# Altium schematic sheet FPGA.SchDoc: Humpback
size 420 x 297 mm; EDA_Number: ARTIQ; Projet: Humpback; Author: G.Kasprowicz; CompanyName: WUT ISE; DrawnBy: G.Kasprowicz; Organization: WUT ISE; Address1: PW ISE; Address2: Nowowiejska 15/19 00-665 Warsaw; Address3: gkasprow@gmail.com; DocumentNumber: 2; Revision: 1.0; SheetNumber: 2; SheetTotal: 11; ModifiedBy: -; CheckedDate: -; Title2: FPGA v1.0; DivGrp: WUT ISE; Designer: G.Kasprowicz; ModifiedDate: -; ProjectName: Sensor Box
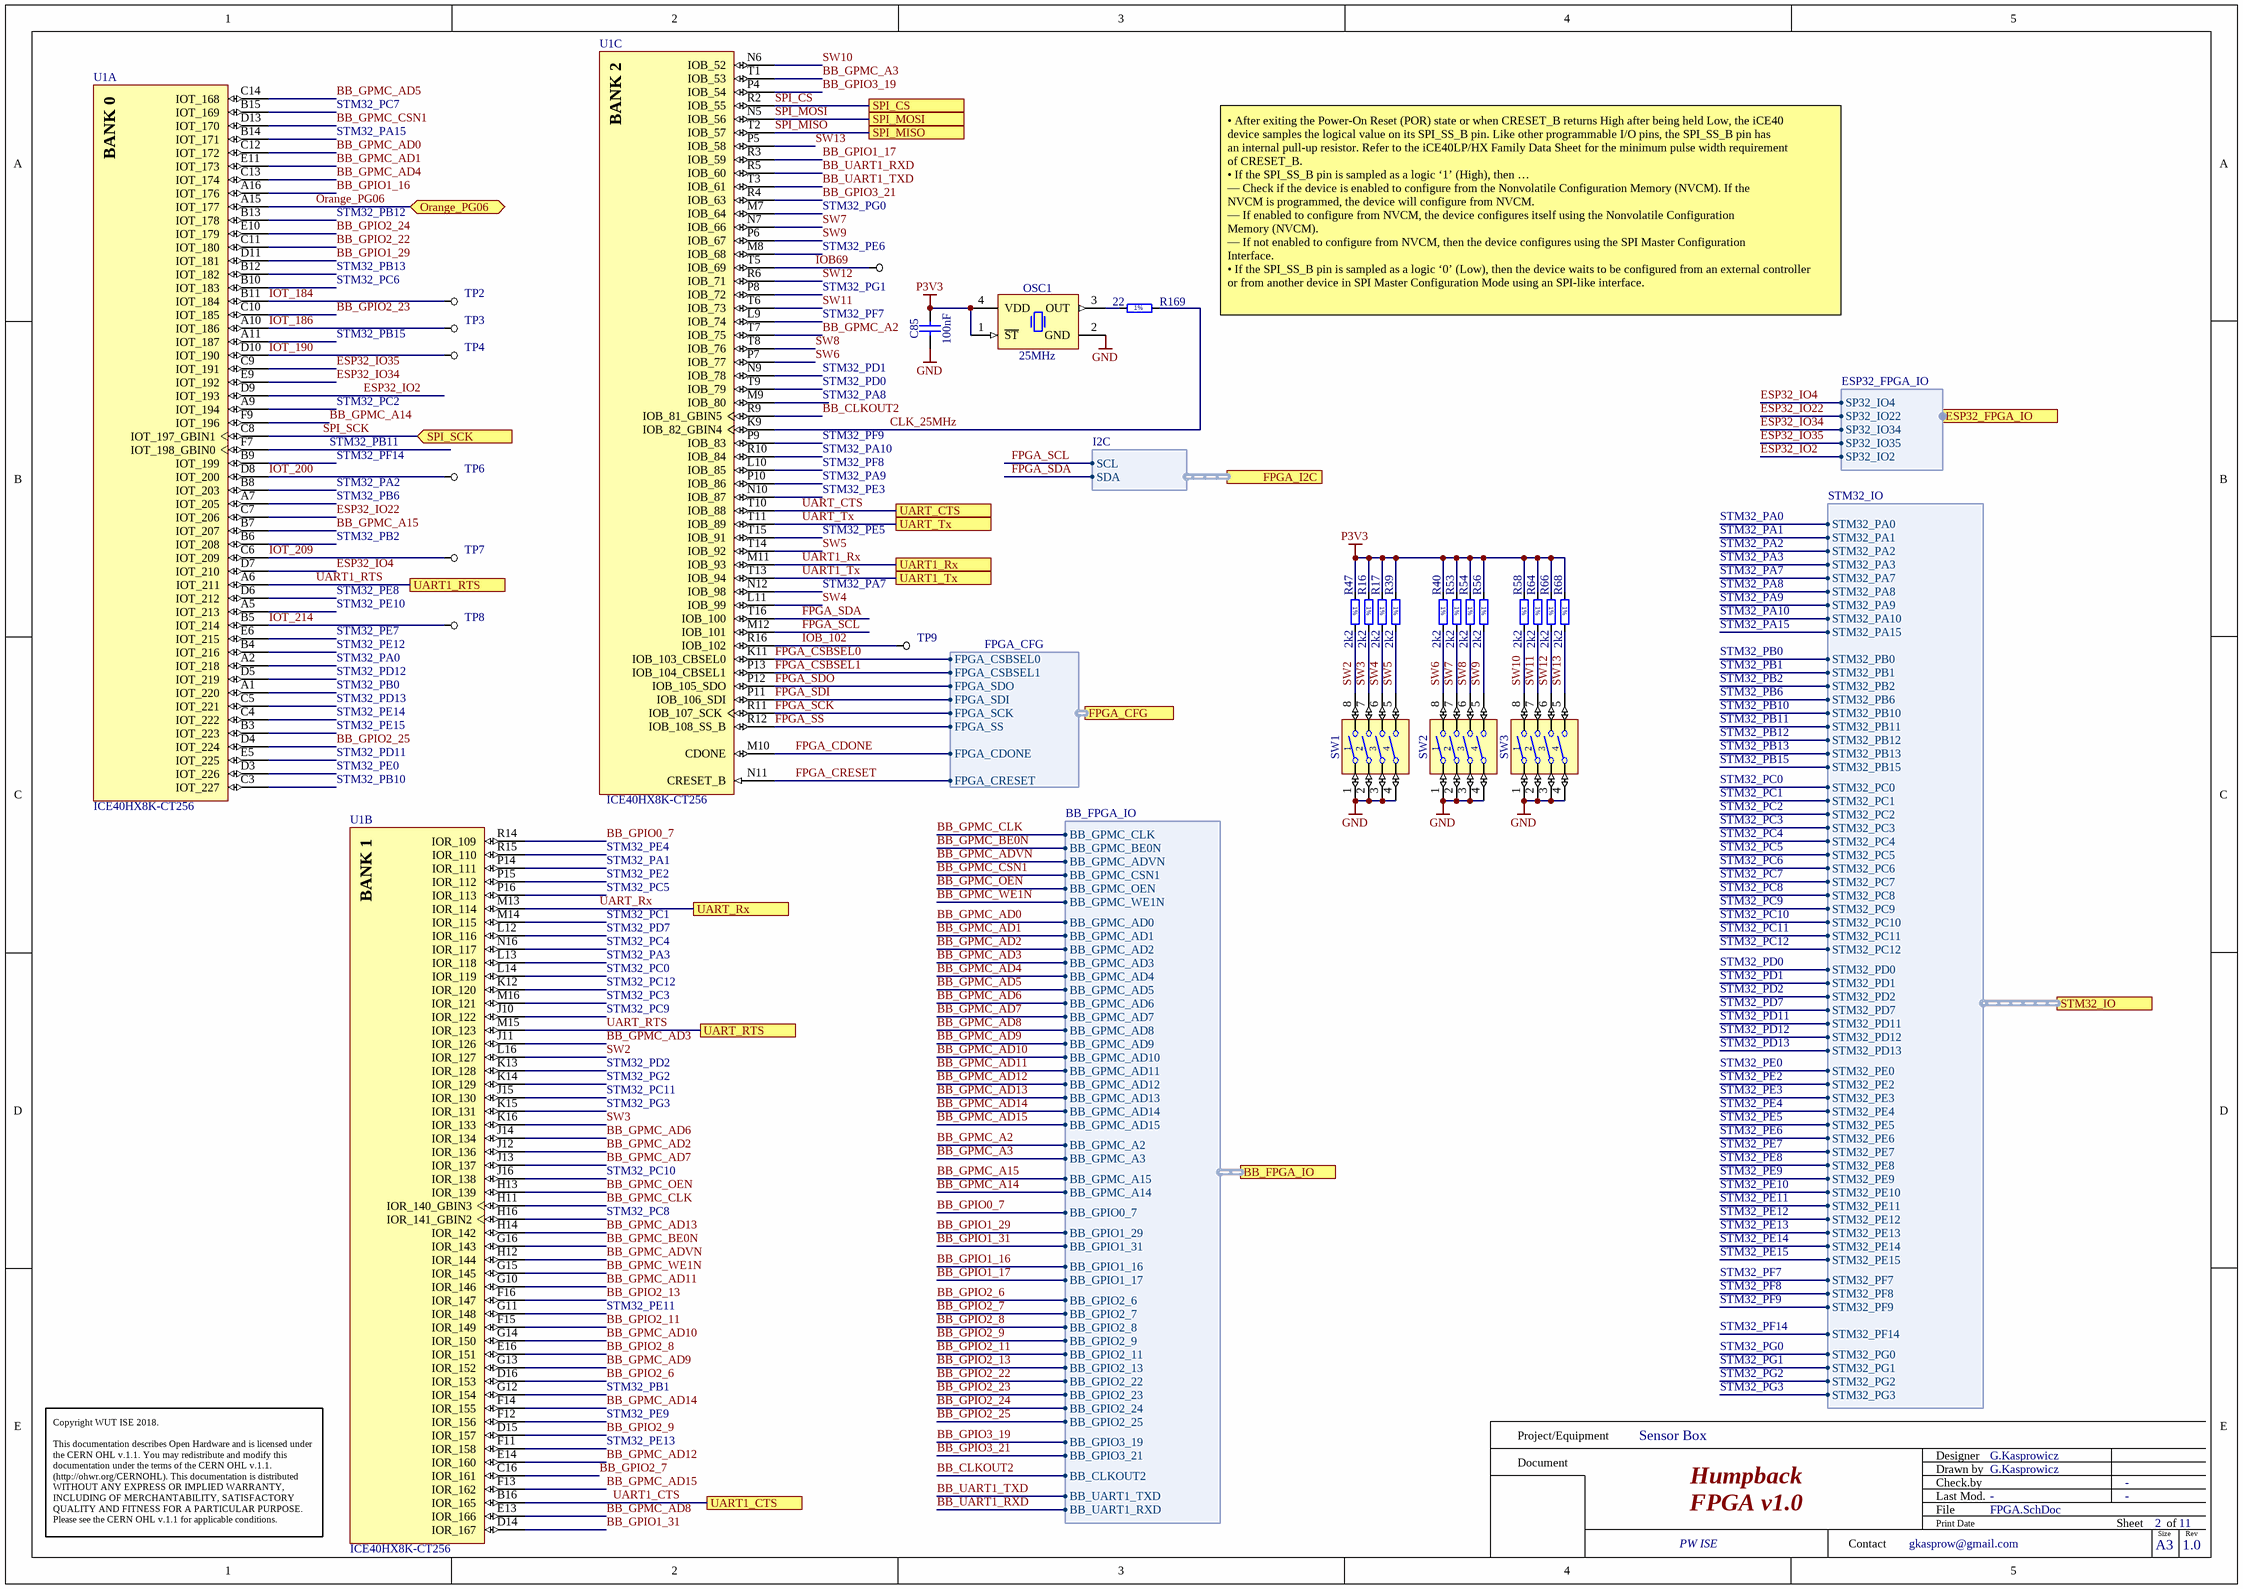
[diagram p0: FPGA.SchDoc]

## Parts
?  TP  [TP]  (value not drawn)
C85  100nF  [CAPC1005X55N]
OSC1  25MHz  [OSC_MICROCHIP_CDFN2520-4LD-PL-1]
R16  2k2  [RESC1005X40N]
R17  2k2  [RESC1005X40N]
R39  2k2  [RESC1005X40N]
R40  2k2  [RESC1005X40N]
R47  2k2  [RESC1005X40N]
R53  2k2  [RESC1005X40N]
R54  2k2  [RESC1005X40N]
R56  2k2  [RESC1005X40N]
R58  2k2  [RESC1005X40N]
R64  2k2  [RESC1005X40N]
R66  2k2  [RESC1005X40N]
R68  2k2  [RESC1005X40N]
R169  22  [RESC1005X40N]
SW1  Switch  [SW_TYCO_1571983-4]  (value not drawn)
SW2  Switch  [SW_TYCO_1571983-4]  (value not drawn)
SW3  Switch  [SW_TYCO_1571983-4]  (value not drawn)
TP2  TP  [TP]  (value not drawn)
TP3  TP  [TP]  (value not drawn)
TP4  TP  [TP]  (value not drawn)
TP6  TP  [TP]  (value not drawn)
TP7  TP  [TP]  (value not drawn)
TP8  TP  [TP]  (value not drawn)
TP9  TP  [TP]  (value not drawn)
U1  ICE40HX8K-CT256  [LATC-caBGA-256]  (parts A,B,C of 5)

## Ports
BB_FPGA_IO (harness BB_FPGA_IO), ESP32_FPGA_IO (harness ESP32_FPGA_IO), FPGA_CFG (harness FPGA_CFG), FPGA_I2C (harness I2C), Orange_PG06 (bidir), SPI_CS, SPI_MISO, SPI_MOSI, SPI_SCK (in), STM32_IO (harness STM32_IO), UART1_CTS, UART1_RTS, UART1_Rx, UART1_Tx, UART_CTS, UART_RTS, UART_Rx, UART_Tx

## Harnesses
I2C: SDA, SCL
FPGA_CFG: FPGA_CSBSEL0, FPGA_CSBSEL1, FPGA_SDO, FPGA_SDI, FPGA_SCK, FPGA_SS, FPGA_CDONE, FPGA_CRESET
STM32_IO: STM32_PA0, STM32_PA1, STM32_PA2, STM32_PA3, STM32_PA7, STM32_PA8, STM32_PA9, STM32_PA10, STM32_PA15, STM32_PB0, STM32_PB1, STM32_PB2, STM32_PB6, STM32_PB10, STM32_PB11, STM32_PB12, STM32_PB13, STM32_PB15, STM32_PC0, STM32_PC1, STM32_PC2, STM32_PC3, STM32_PC4, STM32_PC5, STM32_PC6, STM32_PC7, STM32_PC8, STM32_PC9, STM32_PC10, STM32_PC11, STM32_PC12, STM32_PD0, STM32_PD1, STM32_PD2, STM32_PD7, STM32_PD11, STM32_PD12, STM32_PD13, STM32_PE0, STM32_PE2, STM32_PE3, STM32_PE4, STM32_PE5, STM32_PE6, STM32_PE7, STM32_PE8, STM32_PE9, STM32_PE10, STM32_PE11, STM32_PE12, STM32_PE13, STM32_PE14, STM32_PE15, STM32_PF7, STM32_PF8, STM32_PF9, STM32_PF14, STM32_PG0, STM32_PG1, STM32_PG2, STM32_PG3
BB_FPGA_IO: BB_GPMC_CLK, BB_GPMC_BE0N, BB_GPMC_CSN1, BB_GPMC_OEN, BB_GPMC_AD0, BB_GPMC_AD1, BB_GPMC_AD2, BB_GPMC_AD3, BB_GPMC_AD4, BB_GPMC_AD5, BB_GPMC_AD6, BB_GPMC_AD7, BB_GPMC_AD8, BB_GPMC_AD9, BB_GPMC_AD10, BB_GPMC_AD11, BB_GPMC_AD12, BB_GPMC_AD13, BB_GPMC_AD14, BB_GPMC_AD15, BB_GPMC_A2, BB_GPMC_A3, BB_GPMC_A15, BB_GPMC_A14, BB_GPIO0_7, BB_GPIO1_29, BB_GPIO1_31, BB_GPIO1_16, BB_GPIO1_17, BB_GPIO2_6, BB_GPIO2_7, BB_GPIO2_8, BB_GPIO2_9, BB_GPIO2_11, BB_GPIO2_13, BB_GPIO2_22, BB_GPIO2_23, BB_GPIO2_24, BB_GPIO2_25, BB_GPIO3_19, BB_GPIO3_21, BB_CLKOUT2, BB_UART1_TXD, BB_UART1_RXD, BB_GPMC_ADVN, BB_GPMC_WE1N
ESP32_FPGA_IO: SP32_IO4, SP32_IO22, SP32_IO34, SP32_IO35, SP32_IO2

## Nets
GND: C85.1 OSC1.2(GND) SW1.1 SW1.2 SW1.3 SW1.4 SW2.1 SW2.2 SW2.3 SW2.4 SW3.1 SW3.2 SW3.3 SW3.4
P3V3: C85.2 OSC1.1(~{ST}) OSC1.4(VDD) R16.1 R17.1 R39.1 R40.1 R47.1 R53.1 R54.1 R56.1 R58.1 R64.1 R66.1 R68.1
BB_CLKOUT2: U1.R9(IOB_81_GBIN5) ; port BB_FPGA_IO.BB_CLKOUT2
BB_GPIO0_7: U1.R14(IOR_109) ; port BB_FPGA_IO.BB_GPIO0_7
BB_GPIO1_16: U1.A16(IOT_176) ; port BB_FPGA_IO.BB_GPIO1_16
BB_GPIO1_17: U1.R3(IOB_59) ; port BB_FPGA_IO.BB_GPIO1_17
BB_GPIO1_29: U1.D11(IOT_181) ; port BB_FPGA_IO.BB_GPIO1_29
BB_GPIO1_31: U1.D14(IOR_167) ; port BB_FPGA_IO.BB_GPIO1_31
BB_GPIO2_6: U1.D16(IOR_153) ; port BB_FPGA_IO.BB_GPIO2_6
BB_GPIO2_7: U1.C16(IOR_161) ; port BB_FPGA_IO.BB_GPIO2_7
BB_GPIO2_8: U1.E16(IOR_151) ; port BB_FPGA_IO.BB_GPIO2_8
BB_GPIO2_9: U1.D15(IOR_157) ; port BB_FPGA_IO.BB_GPIO2_9
BB_GPIO2_11: U1.F15(IOR_149) ; port BB_FPGA_IO.BB_GPIO2_11
BB_GPIO2_13: U1.F16(IOR_147) ; port BB_FPGA_IO.BB_GPIO2_13
BB_GPIO2_22: U1.C11(IOT_180) ; port BB_FPGA_IO.BB_GPIO2_22
BB_GPIO2_23: U1.C10(IOT_185) ; port BB_FPGA_IO.BB_GPIO2_23
BB_GPIO2_24: U1.E10(IOT_179) ; port BB_FPGA_IO.BB_GPIO2_24
BB_GPIO2_25: U1.D4(IOT_224) ; port BB_FPGA_IO.BB_GPIO2_25
BB_GPIO3_19: U1.P4(IOB_54) ; port BB_FPGA_IO.BB_GPIO3_19
BB_GPIO3_21: U1.R4(IOB_63) ; port BB_FPGA_IO.BB_GPIO3_21
BB_GPMC_A2: U1.T7(IOB_75) ; port BB_FPGA_IO.BB_GPMC_A2
BB_GPMC_A3: U1.T1(IOB_53) ; port BB_FPGA_IO.BB_GPMC_A3
BB_GPMC_A14: U1.F9(IOT_196) ; port BB_FPGA_IO.BB_GPMC_A14
BB_GPMC_A15: U1.B7(IOT_207) ; port BB_FPGA_IO.BB_GPMC_A15
BB_GPMC_AD0: U1.C12(IOT_172) ; port BB_FPGA_IO.BB_GPMC_AD0
BB_GPMC_AD1: U1.E11(IOT_173) ; port BB_FPGA_IO.BB_GPMC_AD1
BB_GPMC_AD2: U1.J12(IOR_136) ; port BB_FPGA_IO.BB_GPMC_AD2
BB_GPMC_AD3: U1.J11(IOR_126) ; port BB_FPGA_IO.BB_GPMC_AD3
BB_GPMC_AD4: U1.C13(IOT_174) ; port BB_FPGA_IO.BB_GPMC_AD4
BB_GPMC_AD5: U1.C14(IOT_168) ; port BB_FPGA_IO.BB_GPMC_AD5
BB_GPMC_AD6: U1.J14(IOR_134) ; port BB_FPGA_IO.BB_GPMC_AD6
BB_GPMC_AD7: U1.J13(IOR_137) ; port BB_FPGA_IO.BB_GPMC_AD7
BB_GPMC_AD8: U1.E13(IOR_166) ; port BB_FPGA_IO.BB_GPMC_AD8
BB_GPMC_AD9: U1.G13(IOR_152) ; port BB_FPGA_IO.BB_GPMC_AD9
BB_GPMC_AD10: U1.G14(IOR_150) ; port BB_FPGA_IO.BB_GPMC_AD10
BB_GPMC_AD11: U1.G10(IOR_146) ; port BB_FPGA_IO.BB_GPMC_AD11
BB_GPMC_AD12: U1.E14(IOR_160) ; port BB_FPGA_IO.BB_GPMC_AD12
BB_GPMC_AD13: U1.H14(IOR_142) ; port BB_FPGA_IO.BB_GPMC_AD13
BB_GPMC_AD14: U1.F14(IOR_155) ; port BB_FPGA_IO.BB_GPMC_AD14
BB_GPMC_AD15: U1.F13(IOR_162) ; port BB_FPGA_IO.BB_GPMC_AD15
BB_GPMC_ADVN: U1.H12(IOR_144) ; port BB_FPGA_IO.BB_GPMC_ADVN
BB_GPMC_BE0N: U1.G16(IOR_143) ; port BB_FPGA_IO.BB_GPMC_BE0N
BB_GPMC_CLK: U1.H11(IOR_140_GBIN3) ; port BB_FPGA_IO.BB_GPMC_CLK
BB_GPMC_CSN1: U1.D13(IOT_170) ; port BB_FPGA_IO.BB_GPMC_CSN1
BB_GPMC_OEN: U1.H13(IOR_139) ; port BB_FPGA_IO.BB_GPMC_OEN
BB_GPMC_WE1N: U1.G15(IOR_145) ; port BB_FPGA_IO.BB_GPMC_WE1N
BB_UART1_RXD: U1.R5(IOB_60) ; port BB_FPGA_IO.BB_UART1_RXD
BB_UART1_TXD: U1.T3(IOB_61) ; port BB_FPGA_IO.BB_UART1_TXD
CLK_25MHz: R169.2 U1.K9(IOB_82_GBIN4)
ESP32_IO2: U1.D9(IOT_193) ; port ESP32_FPGA_IO.SP32_IO2
ESP32_IO4: U1.D7(IOT_210) ; port ESP32_FPGA_IO.SP32_IO4
ESP32_IO22: U1.C7(IOT_206) ; port ESP32_FPGA_IO.SP32_IO22
ESP32_IO34: U1.E9(IOT_192) ; port ESP32_FPGA_IO.SP32_IO34
ESP32_IO35: U1.C9(IOT_191) ; port ESP32_FPGA_IO.SP32_IO35
FPGA_CDONE: U1.M10(CDONE) ; port FPGA_CFG.FPGA_CDONE
FPGA_CRESET: U1.N11(CRESET_B) ; port FPGA_CFG.FPGA_CRESET
FPGA_CSBSEL0: U1.K11(IOB_103_CBSEL0) ; port FPGA_CFG.FPGA_CSBSEL0
FPGA_CSBSEL1: U1.P13(IOB_104_CBSEL1) ; port FPGA_CFG.FPGA_CSBSEL1
FPGA_SCK: U1.R11(IOB_107_SCK) ; port FPGA_CFG.FPGA_SCK
FPGA_SCL: U1.M12(IOB_101) ; port FPGA_I2C.SCL
FPGA_SDA: U1.T16(IOB_100) ; port FPGA_I2C.SDA
FPGA_SDI: U1.P11(IOB_106_SDI) ; port FPGA_CFG.FPGA_SDI
FPGA_SDO: U1.P12(IOB_105_SDO) ; port FPGA_CFG.FPGA_SDO
FPGA_SS: U1.R12(IOB_108_SS_B) ; port FPGA_CFG.FPGA_SS
IOB69: ?.1 U1.T5(IOB_69)
IOB_102: TP9.1 U1.R16(IOB_102)
IOT_184: TP2.1 U1.B11(IOT_184)
IOT_186: TP3.1 U1.A10(IOT_186)
IOT_190: TP4.1 U1.D10(IOT_190)
IOT_200: TP6.1 U1.D8(IOT_200)
IOT_209: TP7.1 U1.C6(IOT_209)
IOT_214: TP8.1 U1.B5(IOT_214)
Orange_PG06: U1.A15(IOT_177) ; port Orange_PG06
SPI_CS: U1.R2(IOB_55) ; port SPI_CS
SPI_MISO: U1.T2(IOB_57) ; port SPI_MISO
SPI_MOSI: U1.N5(IOB_56) ; port SPI_MOSI
SPI_SCK: U1.C8(IOT_197_GBIN1) ; port SPI_SCK
STM32_PA0: U1.A2(IOT_218) ; port STM32_IO.STM32_PA0
STM32_PA1: U1.P14(IOR_111) ; port STM32_IO.STM32_PA1
STM32_PA2: U1.B8(IOT_203) ; port STM32_IO.STM32_PA2
STM32_PA3: U1.L13(IOR_118) ; port STM32_IO.STM32_PA3
STM32_PA7: U1.N12(IOB_98) ; port STM32_IO.STM32_PA7
STM32_PA8: U1.M9(IOB_80) ; port STM32_IO.STM32_PA8
STM32_PA9: U1.P10(IOB_86) ; port STM32_IO.STM32_PA9
STM32_PA10: U1.R10(IOB_84) ; port STM32_IO.STM32_PA10
STM32_PA15: U1.B14(IOT_171) ; port STM32_IO.STM32_PA15
STM32_PB0: U1.A1(IOT_220) ; port STM32_IO.STM32_PB0
STM32_PB1: U1.G12(IOR_154) ; port STM32_IO.STM32_PB1
STM32_PB2: U1.B6(IOT_208) ; port STM32_IO.STM32_PB2
STM32_PB6: U1.A7(IOT_205) ; port STM32_IO.STM32_PB6
STM32_PB10: U1.C3(IOT_227) ; port STM32_IO.STM32_PB10
STM32_PB11: U1.F7(IOT_198_GBIN0) ; port STM32_IO.STM32_PB11
STM32_PB12: U1.B13(IOT_178) ; port STM32_IO.STM32_PB12
STM32_PB13: U1.B12(IOT_182) ; port STM32_IO.STM32_PB13
STM32_PB15: U1.A11(IOT_187) ; port STM32_IO.STM32_PB15
STM32_PC0: U1.L14(IOR_119) ; port STM32_IO.STM32_PC0
STM32_PC1: U1.M14(IOR_115) ; port STM32_IO.STM32_PC1
STM32_PC2: U1.A9(IOT_194) ; port STM32_IO.STM32_PC2
STM32_PC3: U1.M16(IOR_121) ; port STM32_IO.STM32_PC3
STM32_PC4: U1.N16(IOR_117) ; port STM32_IO.STM32_PC4
STM32_PC5: U1.P16(IOR_113) ; port STM32_IO.STM32_PC5
STM32_PC6: U1.B10(IOT_183) ; port STM32_IO.STM32_PC6
STM32_PC7: U1.B15(IOT_169) ; port STM32_IO.STM32_PC7
STM32_PC8: U1.H16(IOR_141_GBIN2) ; port STM32_IO.STM32_PC8
STM32_PC9: U1.J10(IOR_122) ; port STM32_IO.STM32_PC9
STM32_PC10: U1.J16(IOR_138) ; port STM32_IO.STM32_PC10
STM32_PC11: U1.J15(IOR_130) ; port STM32_IO.STM32_PC11
STM32_PC12: U1.K12(IOR_120) ; port STM32_IO.STM32_PC12
STM32_PD0: U1.T9(IOB_79) ; port STM32_IO.STM32_PD0
STM32_PD1: U1.N9(IOB_78) ; port STM32_IO.STM32_PD1
STM32_PD2: U1.K13(IOR_128) ; port STM32_IO.STM32_PD2
STM32_PD7: U1.L12(IOR_116) ; port STM32_IO.STM32_PD7
STM32_PD11: U1.E5(IOT_225) ; port STM32_IO.STM32_PD11
STM32_PD12: U1.D5(IOT_219) ; port STM32_IO.STM32_PD12
STM32_PD13: U1.C5(IOT_221) ; port STM32_IO.STM32_PD13
STM32_PE0: U1.D3(IOT_226) ; port STM32_IO.STM32_PE0
STM32_PE2: U1.P15(IOR_112) ; port STM32_IO.STM32_PE2
STM32_PE3: U1.N10(IOB_87) ; port STM32_IO.STM32_PE3
STM32_PE4: U1.R15(IOR_110) ; port STM32_IO.STM32_PE4
STM32_PE5: U1.T15(IOB_91) ; port STM32_IO.STM32_PE5
STM32_PE6: U1.M8(IOB_68) ; port STM32_IO.STM32_PE6
STM32_PE7: U1.E6(IOT_215) ; port STM32_IO.STM32_PE7
STM32_PE8: U1.D6(IOT_212) ; port STM32_IO.STM32_PE8
STM32_PE9: U1.F12(IOR_156) ; port STM32_IO.STM32_PE9
STM32_PE10: U1.A5(IOT_213) ; port STM32_IO.STM32_PE10
STM32_PE11: U1.G11(IOR_148) ; port STM32_IO.STM32_PE11
STM32_PE12: U1.B4(IOT_216) ; port STM32_IO.STM32_PE12
STM32_PE13: U1.F11(IOR_158) ; port STM32_IO.STM32_PE13
STM32_PE14: U1.C4(IOT_222) ; port STM32_IO.STM32_PE14
STM32_PE15: U1.B3(IOT_223) ; port STM32_IO.STM32_PE15
STM32_PF7: U1.L9(IOB_74) ; port STM32_IO.STM32_PF7
STM32_PF8: U1.L10(IOB_85) ; port STM32_IO.STM32_PF8
STM32_PF9: U1.P9(IOB_83) ; port STM32_IO.STM32_PF9
STM32_PF14: U1.B9(IOT_199) ; port STM32_IO.STM32_PF14
STM32_PG0: U1.M7(IOB_64) ; port STM32_IO.STM32_PG0
STM32_PG1: U1.P8(IOB_72) ; port STM32_IO.STM32_PG1
STM32_PG2: U1.K14(IOR_129) ; port STM32_IO.STM32_PG2
STM32_PG3: U1.K15(IOR_131) ; port STM32_IO.STM32_PG3
SW2: R47.2 SW1.8 U1.L16(IOR_127)
SW3: R16.2 SW1.7 U1.K16(IOR_133)
SW4: R17.2 SW1.6 U1.L11(IOB_99)
SW5: R39.2 SW1.5 U1.T14(IOB_92)
SW6: R40.2 SW2.8 U1.P7(IOB_77)
SW7: R53.2 SW2.7 U1.N7(IOB_66)
SW8: R54.2 SW2.6 U1.T8(IOB_76)
SW9: R56.2 SW2.5 U1.P6(IOB_67)
SW10: R58.2 SW3.8 U1.N6(IOB_52)
SW11: R64.2 SW3.7 U1.T6(IOB_73)
SW12: R66.2 SW3.6 U1.R6(IOB_71)
SW13: R68.2 SW3.5 U1.P5(IOB_58)
UART1_CTS: U1.B16(IOR_165) ; port UART1_CTS
UART1_RTS: U1.A6(IOT_211) ; port UART1_RTS
UART1_Rx: U1.M11(IOB_93) ; port UART1_Rx
UART1_Tx: U1.T13(IOB_94) ; port UART1_Tx
UART_CTS: U1.T10(IOB_88) ; port UART_CTS
UART_RTS: U1.M15(IOR_123) ; port UART_RTS
UART_Rx: U1.M13(IOR_114) ; port UART_Rx
UART_Tx: U1.T11(IOB_89) ; port UART_Tx
NetOSC1_3: OSC1.3(OUT) R169.1

## Notes on the sheet
- • After exiting the Power-On Reset (POR) state or when CRESET_B returns High after being held Low, the iCE40
  device samples the logical value on its SPI_SS_B pin. Like other programmable I/O pins, the SPI_SS_B pin has
  an internal pull-up resistor. Refer to the iCE40LP/HX Family Data Sheet for the minimum pulse width requirement
  of CRESET_B.
  • If the SPI_SS_B pin is sampled as a logic ‘1’ (High), then …
  — Check if the device is enabled to configure from the Nonvolatile Configuration Memory (NVCM). If the
  NVCM is programmed, the device will configure from NVCM.
  — If enabled to configure from NVCM, the device configures itself using the Nonvolatile Configuration
  Memory (NVCM).
  — If not enabled to configure from NVCM, then the device configures using the SPI Master Configuration
  Interface.
  • If the SPI_SS_B pin is sampled as a logic ‘0’ (Low), then the device waits to be configured from an external controller
  or from another device in SPI Master Configuration Mode using an SPI-like interface.
- Project/Equipment
- Document
- Designer
- Drawn by
- Check.by
- Copyright WUT ISE 2018.
  This documentation describes Open Hardware and is licensed under the CERN OHL v.1.1. You may redistribute and modify this documentation under the terms of the CERN OHL v.1.1. (http://ohwr.org/CERNOHL). This documentation is distributed WITHOUT ANY EXPRESS OR IMPLIED WARRANTY, INCLUDING OF MERCHANTABILITY, SATISFACTORY QUALITY AND FITNESS FOR A PARTICULAR PURPOSE. Please see the CERN OHL v.1.1 for applicable conditions.
- Contact
- File
- Last Mod.
- Print Date
- Sheet
- Size
- A3
- of
- Rev
- (in symbol CMP-0962-00001-1, part A) BANK 0
- (in symbol CMP-0962-00001-1, part B) BANK 1
- (in symbol CMP-0962-00001-1, part C) BANK 2
- (in symbol R0402_2K2_1%_0.0625W_100PPM) 1%
- (in symbol R0402_22R_1%_0.0625W_100PPM) 1%

## Library data of the parts
? TP2-TP4 TP6-TP9 = TP: Testpoint
C85 = CC0402_100NF_16V_10%_X5R: Non-polarised capacitor; Part Description: SMD Multilayer Chip Ceramic Capacitor; Manufacturer: GENERIC; Manufacturer1 Part Number: GRM155R61C104KA88D; Voltage: 16V; TC: X5R; Tolerance: ±10%; Part Number: CC0402_100NF_16V_10%_X5R; Component Kind: Standard; Component Type: Standard; Pin Count: 2; Value: 100nF; Status: None; Manufacturer Part Number: CC0402_100NF_16V_10%_X5R; Case: 0402; Mounted: Yes; Socket: No; SMD: Yes; Sense: No; Manufacturer1 Example: MURATA; Manufacturer1 ComponentHeight: 0.55mm; HelpURL: \\cern.ch\dfs\Applications\Altium\Datasheets\CC0402_X5R_MURATA_GRM.pdf; Author: CERN DEM JLC; CreateDate: 10.12.2013; LatestRevisionDate: 10.12.2013
OSC1 = OSC_25MHZ_MICROCHIP_DSC1003DL5-025.0000: Oscillator 4 pins 1=S\T\ 2=GND 3=OUT 4=VDD; Part Description: 1.8V-3.3V, ±10ppm, 25pF,-40..105°C, Surface Mount Low-Power Precision CMOS Oscillator (DSC1001 Series); Manufacturer: MICROCHIP TECHNOLOGY; PressFit: No; Bonding: No; Part Number: OSC_25MHZ_MICROCHIP_DSC1003DL5-025.0000; Component Kind: Standard; Component Type: Standard; PackageDescription: MICROCHIP Case CDFN2520-4LD-PL-1, SMD Oscillator, DFN, 4 pins, 2.5mm x 2.0mm; Value: 25MHz; Manufacturer Part Number: DSC1003DL5-025.0000; Pin Count: 4; Mounted: Yes; Socket: No; SMD: Yes; Sense: No; ComponentHeight: 0.9mm; HelpURL: \\cern.ch\dfs\Applications\Altium\Datasheets\OSC_MICROCHIP_DSC1003.pdf; Author: CERN DEM JLC; CreateDate: 16/08/2018; LatestRevisionDate: 16/08/2018
R16 R17 R39 R40 R47 R53 R54 R56 R58 R64 R66 R68 = R0402_2K2_1%_0.0625W_100PPM: Resistor - 1%; Part Description: General Purpose Thick Film Chip Resistor; Manufacturer: GENERIC; Manufacturer1 Part Number: 232270672202L; TC: ±100ppm/°C; Table: Resistors SMD; Part Number: R0402_2K2_1%_0.0625W_100PPM; Component Kind: Standard; Component Type: Standard; Pin Count: 2; Value: 2k2; Status: Not recommended; Power: 0.0625W; Tolerance: ±1%; Manufacturer Part Number: R0402_2K2_1%_0.0625W_100PPM; Case: 0402; Mounted: Yes; Socket: No; SMD: Yes; Manufacturer1 Example: YAGEO PHYCOMP; Manufacturer1 ComponentHeight: 0.4mm; HelpURL: \\cern.ch\dfs\Applications\Altium\Datasheets\R0402_Phycomp_RC0402.pdf; Author: CERN DEM JLC; CreateDate: 2007-12-03; LatestRevisionDate: 2012-10-17
R169 = R0402_22R_1%_0.0625W_100PPM: Resistor - 1%; Part Description: General Purpose Thick Film Chip Resistor; Manufacturer: GENERIC; Manufacturer1 Part Number: 232270672209L; TC: ±100ppm/°C; PressFit: No; Part Number: R0402_22R_1%_0.0625W_100PPM; Component Kind: Standard; Component Type: Standard; Pin Count: 2; Value: 22; Status: Not Recommended; Power: 0.0625W; Tolerance: ±1%; Manufacturer Part Number: R0402_22R_1%_0.0625W_100PPM; Case: 0402; Mounted: Yes; Sense: No; Socket: No; SMD: Yes; Manufacturer1 Example: YAGEO PHYCOMP; Manufacturer1 ComponentHeight: 0.4mm; HelpURL: \\cern.ch\dfs\Applications\Altium\Datasheets\R0402_Phycomp_RC0402.pdf; Author: CERN DEM JLC; CreateDate: 03/12/2007; LatestRevisionDate: 17/10/2012
SW1-SW3 = SW_TYCO_1571983-4: 4 Ways SPST DIP Switch; Part Description: 4 Way SPST SMD DIP Switch, Latched, Contact Rating 0.025A 24VDC; Manufacturer: TYCO; Manufacturer Part Number: 1571983-4 or GDH04S04; PressFit: No; Part Number: SW_TYCO_1571983-4; Component Kind: Standard; Component Type: Standard; Pin Count: 8; PackageDescription: Pitch 1.27mm,  Body 6.2x6.2mm, 4 Ways SPST Surface-Mount DIP Switch, TYCO GDH Series; Family: Switch; Mounted: Yes; Socket: No; SMD: Yes; Sense: No; Status: None; ComponentHeight: 2.31mm; HelpURL: \\cern.ch\dfs\Applications\Altium\Datasheets\SW_TYCO_1571983-4.pdf; Author: CERN DEM JLC; CreateDate: 08/01/2009; LatestRevisionDate: 08/01/2009
U1 = CMP-0962-00001-1: iCE40 HX8K Series FPGA Family, 7680 Logic Cells, 1.2 V Core, 128 K Embedded RAM Bits, 256-ball caBGA, Pb-Free, Tray; Manufacturer: Lattice Semiconductor; Supply Voltage: 1.2V; Phase-Locked Loops: 2; Logic Cells: 7680; Embedded RAM Bits: 128K; PackageReference: caBGA-256; PackageDescription: 256-Ball Chip Array Ball Grid Array, Body 14 x 14 mm, Pitch 0.8 mm; RoHS: TRUE; Packing: Tray; Mounting Technology: Surface Mount; ComponentLink3URL: http://www.latticesemi.com/lit/docs/package/pkg.pdf; ComponentLink1Description: Manufacturer URL; ComponentLink3Description: Package Specification; Code_JEDEC: MO-275; PackageVersion: Rev. 03.9, 02/2013; ComponentLink1URL: http://www.latticesemi.com/en; ComponentLink2URL: http://www.latticesemi.com/~/media/Documents/DataSheets/iCE/iCE40LPHXFamilyDataSheet.pdf; PartNumber: ICE40HX8K-CT256; ComponentLink2Description: Datasheet; DatasheetVersion: Rev. 02.9